# EAGLE schematic schematic (EAGLE 9.7.0)
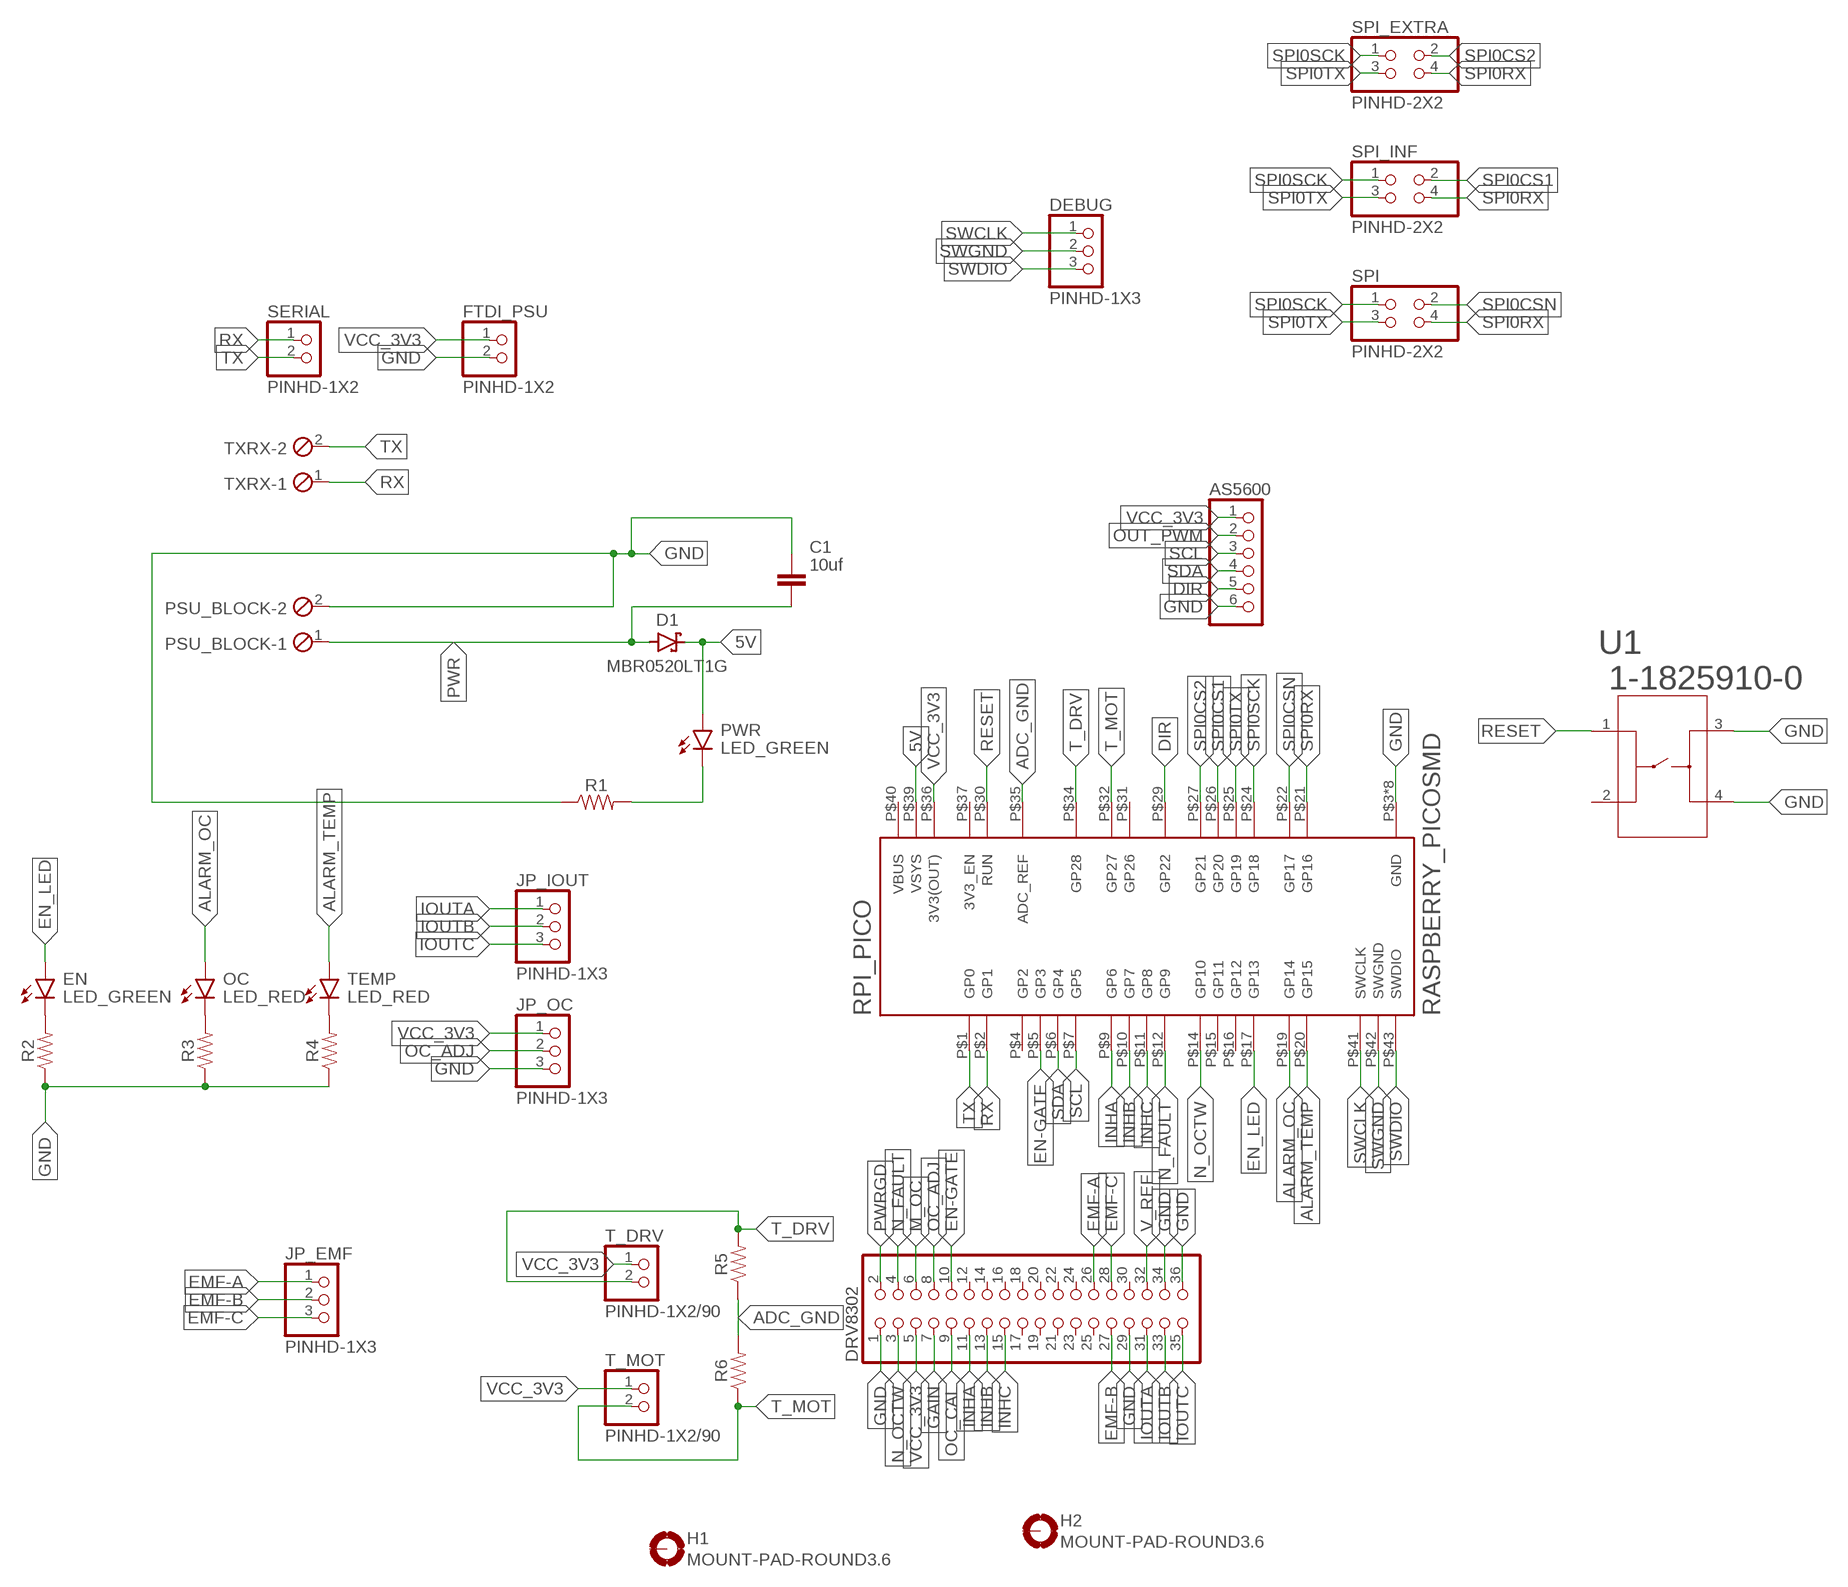
[diagram p0: schematic, sheet 1]

## Parts
AS5600  PINHD-1X6/90  [1X06/90]
C1  10uf  C_CHIP-0805(2012-METRIC)  [CAPC2012X110]
D1  MBR0520LT1G  SCHOTTKY_MBR0520LT1GDO-219  [SODFL3718X115]
DEBUG  PINHD-1X3  [1X03]
DRV8302  PINHD-2X18  [2X18]
EN  LED_GREEN  CHIP-FLAT-G_1206  [LEDC3216X75N_FLAT-G]
FTDI_PSU  PINHD-1X2  [1X02]
H1  MOUNT-PAD-ROUND3.6  [3,6-PAD]
H2  MOUNT-PAD-ROUND3.6  [3,6-PAD]
JP_EMF  PINHD-1X3  [1X03]
JP_IOUT  PINHD-1X3  [1X03]
JP_OC  PINHD-1X3  [1X03]
OC  LED_RED  CHIP-FLAT-R_1206  [LEDC3216X75N_FLAT-R]
PSU_BLOCK  MPT2  [2POL254]
PWR  LED_GREEN  CHIP-FLAT-G_1206  [LEDC3216X75N_FLAT-G]
R1  RESISTOR0805  [0805]
R2  RESISTOR0805  [0805]
R3  RESISTOR0805  [0805]
R4  RESISTOR0805  [0805]
R5  RESISTOR0805  [0805]
R6  RESISTOR0805  [0805]
RPI_PICO  RASPBERRY_PICOSMD  [PICO-PKG-SMD]
SERIAL  PINHD-1X2  [1X02]
SPI  PINHD-2X2  [2X02]
SPI_EXTRA  PINHD-2X2  [2X02]
SPI_INF  PINHD-2X2  [2X02]
T_DRV  PINHD-1X2/90  [1X02/90]
T_MOT  PINHD-1X2/90  [1X02/90]
TEMP  LED_RED  CHIP-FLAT-R_1206  [LEDC3216X75N_FLAT-R]
TXRX  MPT2  [2POL254]
U1  1-1825910-0  [SWITCH_1-1825910-0]

## Nets
5V: D1.1(C) PWR.A RPI_PICO.P$39(VSYS)
ADC_GND: R5.1 R6.2 RPI_PICO.P$35(ADC_REF)
ALARM_OC: OC.A RPI_PICO.P$19(GP14)
ALARM_TEMP: RPI_PICO.P$20(GP15) TEMP.A
DIR: AS5600.5 RPI_PICO.P$29(GP22)
EMF-A: DRV8302.26 JP_EMF.1
EMF-B: DRV8302.27 JP_EMF.2
EMF-C: DRV8302.28 JP_EMF.3
EN-GATE: DRV8302.10 RPI_PICO.P$5(GP3)
EN_LED: EN.A RPI_PICO.P$17(GP13)
GAIN: DRV8302.7
GND: AS5600.6 C1.1 DRV8302.1 DRV8302.29 DRV8302.34 DRV8302.36 FTDI_PSU.2 JP_OC.3 PSU_BLOCK.2 R1.1 R2.1 R3.1 R4.1 RPI_PICO.P$3(GND) RPI_PICO.P$8(GND) RPI_PICO.P$13(GND) RPI_PICO.P$18(GND) RPI_PICO.P$23(GND) RPI_PICO.P$28(GND) RPI_PICO.P$33(GND) RPI_PICO.P$38(GND) U1.3 U1.4
INHA: DRV8302.11 RPI_PICO.P$9(GP6)
INHB: DRV8302.13 RPI_PICO.P$10(GP7)
INHC: DRV8302.15 RPI_PICO.P$11(GP8)
IOUTA: DRV8302.31 JP_IOUT.1
IOUTB: DRV8302.33 JP_IOUT.2
IOUTC: DRV8302.35 JP_IOUT.3
M_OC: DRV8302.6
N$1: PWR.C R1.2
N$2: OC.C R3.2
N$3: EN.C R2.2
N$4: R4.2 TEMP.C
N_FAULT: DRV8302.4 RPI_PICO.P$12(GP9)
N_OCTW: DRV8302.3 RPI_PICO.P$14(GP10)
OC_ADJ: DRV8302.8 JP_OC.2
OC_CAL: DRV8302.9
OUT_PWM: AS5600.2
PWR: C1.2 D1.2(A) PSU_BLOCK.1
PWRGD: DRV8302.2
RESET: RPI_PICO.P$30(RUN) U1.1
RX: RPI_PICO.P$2(GP1) SERIAL.1 TXRX.1
SCL: AS5600.3 RPI_PICO.P$7(GP5)
SDA: AS5600.4 RPI_PICO.P$6(GP4)
SPI0CS1: RPI_PICO.P$26(GP20) SPI_INF.2
SPI0CS2: RPI_PICO.P$27(GP21) SPI_EXTRA.2
SPI0CSN: RPI_PICO.P$22(GP17) SPI.2
SPI0RX: RPI_PICO.P$21(GP16) SPI.4 SPI_EXTRA.4 SPI_INF.4
SPI0SCK: RPI_PICO.P$24(GP18) SPI.1 SPI_EXTRA.1 SPI_INF.1
SPI0TX: RPI_PICO.P$25(GP19) SPI.3 SPI_EXTRA.3 SPI_INF.3
SWCLK: DEBUG.1 RPI_PICO.P$41(SWCLK)
SWDIO: DEBUG.3 RPI_PICO.P$43(SWDIO)
SWGND: DEBUG.2 RPI_PICO.P$42(SWGND)
T_DRV: R5.2 RPI_PICO.P$34(GP28) T_DRV.2
T_MOT: R6.1 RPI_PICO.P$32(GP27) T_MOT.2
TX: RPI_PICO.P$1(GP0) SERIAL.2 TXRX.2
V_REF: DRV8302.32
VCC_3V3: AS5600.1 DRV8302.5 FTDI_PSU.1 JP_OC.1 RPI_PICO.P$36(3V3(OUT)) T_DRV.1 T_MOT.1
Unconnected: DRV8302.12 DRV8302.14 DRV8302.16 DRV8302.17 DRV8302.18 DRV8302.19 DRV8302.20 DRV8302.21 DRV8302.22 DRV8302.23 DRV8302.24 DRV8302.25 DRV8302.30 H1.B3,6(MOUNT) H2.B3,6(MOUNT) RPI_PICO.P$4(GP2) RPI_PICO.P$15(GP11) RPI_PICO.P$16(GP12) RPI_PICO.P$31(GP26) RPI_PICO.P$37(3V3_EN) U1.2

## Power pins joined to a net without a drawn wire
VBUS: RPI_PICO.P$40(VBUS)

## Library data of the parts
AS5600 = pinhead:PINHD-1X6: PIN HEADER
C1 = Capacitor:C: Capacitor - Generic; CATEGORY: Capacitor
D1 = Diode:SCHOTTKY_: Schottky Diode - Popular parts; CATEGORY: Diode; DESCRIPTION: DIODE SCHOTTKY 20V 500MA SOD123; MANUFACTURER: ON Semiconductor; MPN: MBR0520LT1G; SUB-CATEGORY: Schottky
DEBUG JP_EMF JP_IOUT JP_OC = Connector:PINHD-1X3: PIN HEADER; CATEGORY: CONNECTOR; SUB-CATEGORY: PIN-HEADER
DRV8302 = pinhead:PINHD-2X18: PIN HEADER
EN PWR = LED:CHIP-FLAT-G; CATEGORY: LED; COLOR: GREEN; DESCRIPTION: CHIP LED FLAT; SUB-CATEGORY: CHIP; TYPE: FLAT_TOP
FTDI_PSU SERIAL = Connector:PINHD-1X2: PIN HEADER; CATEGORY: Headers; DESCRIPTION: Header, Straight, 2 Position; MANUFACTURER: Generic; MPN: Generic; OPERATING_TEMPERATURE: Generic; PART_STATUS: Active; PITCH: 0.100" (2.54mm); ROHS_COMPLIANCE: Generic; SERIES: Generic; SUB-CATEGORY: Headers, Male Pins; TYPE: Board to Board or Cable, Unshrouded, Through Hole, Straight
H1 H2 = holes:MOUNT-PAD-ROUND: MOUNTING PAD, round
OC TEMP = LED:CHIP-FLAT-R; CATEGORY: LED; COLOR: RED; DESCRIPTION: CHIP LED FLAT; SUB-CATEGORY: CHIP; TYPE: FLAT_TOP
PSU_BLOCK TXRX = con-phoenix-254:MPT2: PHOENIX CONNECTOR; OC_FARNELL: unknown; OC_NEWARK: unknown
R1-R6 = SparkFun-Resistors:RESISTOR: Generic Resistor Package
RPI_PICO = RpiPico:RASPBERRY_PICO: Raspberry Pi Pico
SPI SPI_EXTRA SPI_INF = Connector:PINHD-2X2: PIN HEADER; CATEGORY: CONNECTOR; SUB-CATEGORY: PIN-HEADER
T_DRV T_MOT = Connector:PINHD-1X2: PIN HEADER; CATEGORY: Headers; DESCRIPTION: Header, Right Angle, 2 Position; MANUFACTURER: Generic; MPN: Generic; OPERATING_TEMPERATURE: Generic; PART_STATUS: Active; PITCH: 0.100" (2.54mm); ROHS_COMPLIANCE: Generic; SERIES: Generic; SUB-CATEGORY: Headers, Male Pins; TYPE: Board to Board or Cable, Unshrouded, Through Hole, Right Angle
U1 = Switches:1-1825910-0; BUILT_BY: EMA_UL_Team; CATEGORY: Tactile Switches; COPYRIGHT: Copyright (C) 2016 Accelerated Designs. All rights reserved; DESCRIPTION: FSM6JH=6MM TACT SWITCH, HIGH TEMP; MANUFACTURER_PART_NUMBER: 1-1825910-0; PART_STATUS: active; SERIES: Unknown; VENDOR: TE Connectivity